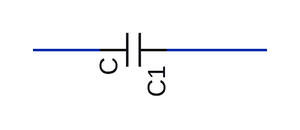
[diagram p0: schematic test2.asc]
test2.asc, the LTspice schematic file:
Version 4
SHEET 1 880 680
WIRE 208 176 144 176
WIRE 368 176 272 176
SYMBOL cap 272 160 R90
WINDOW 0 31 10 Left 2
SYMATTR InstName C1

The netlist it stands for:
* test2.asc
C1 N002 N001 C
.backanno
.end